# Altium schematic sheet LineFollowerSensor.SchDoc: das
size 635 x 281 mm
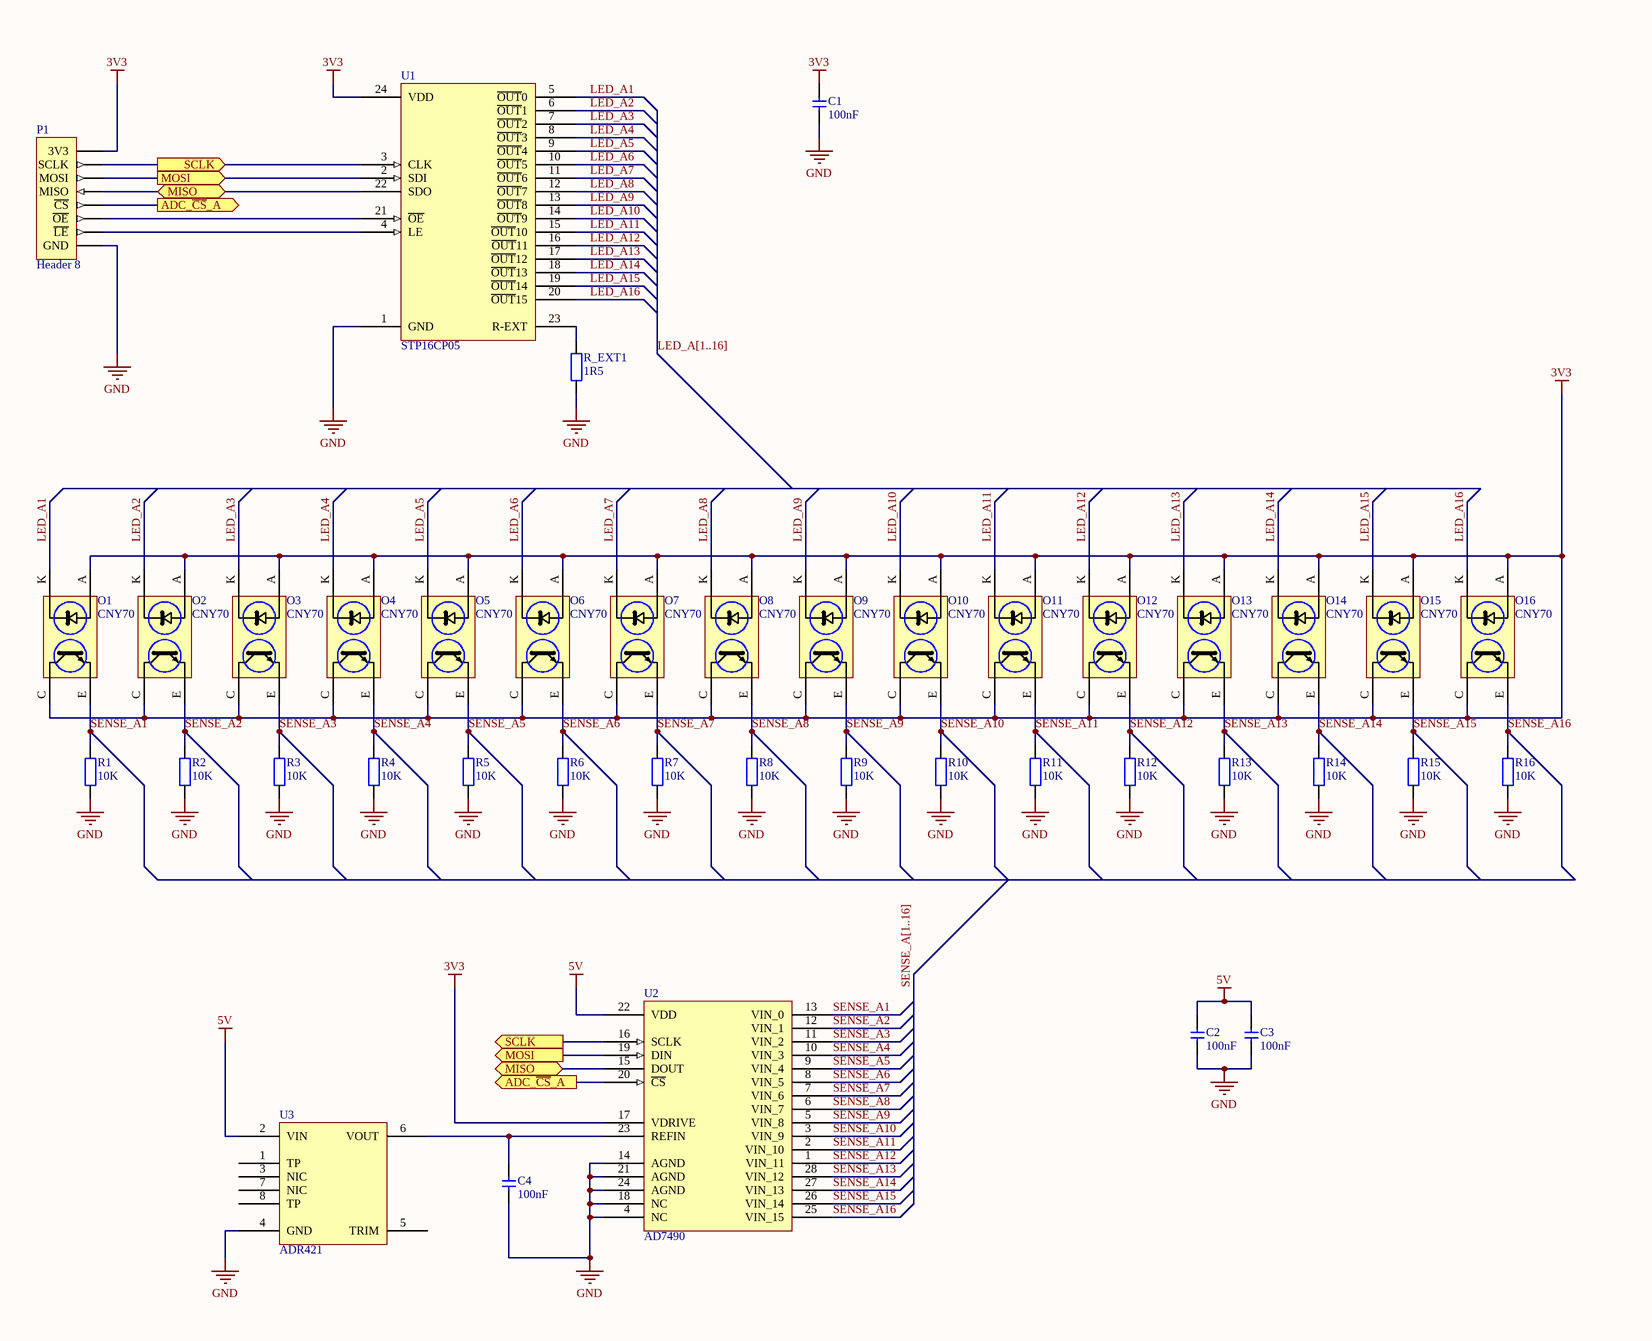
[diagram p0: LineFollowerSensor.SchDoc, left]
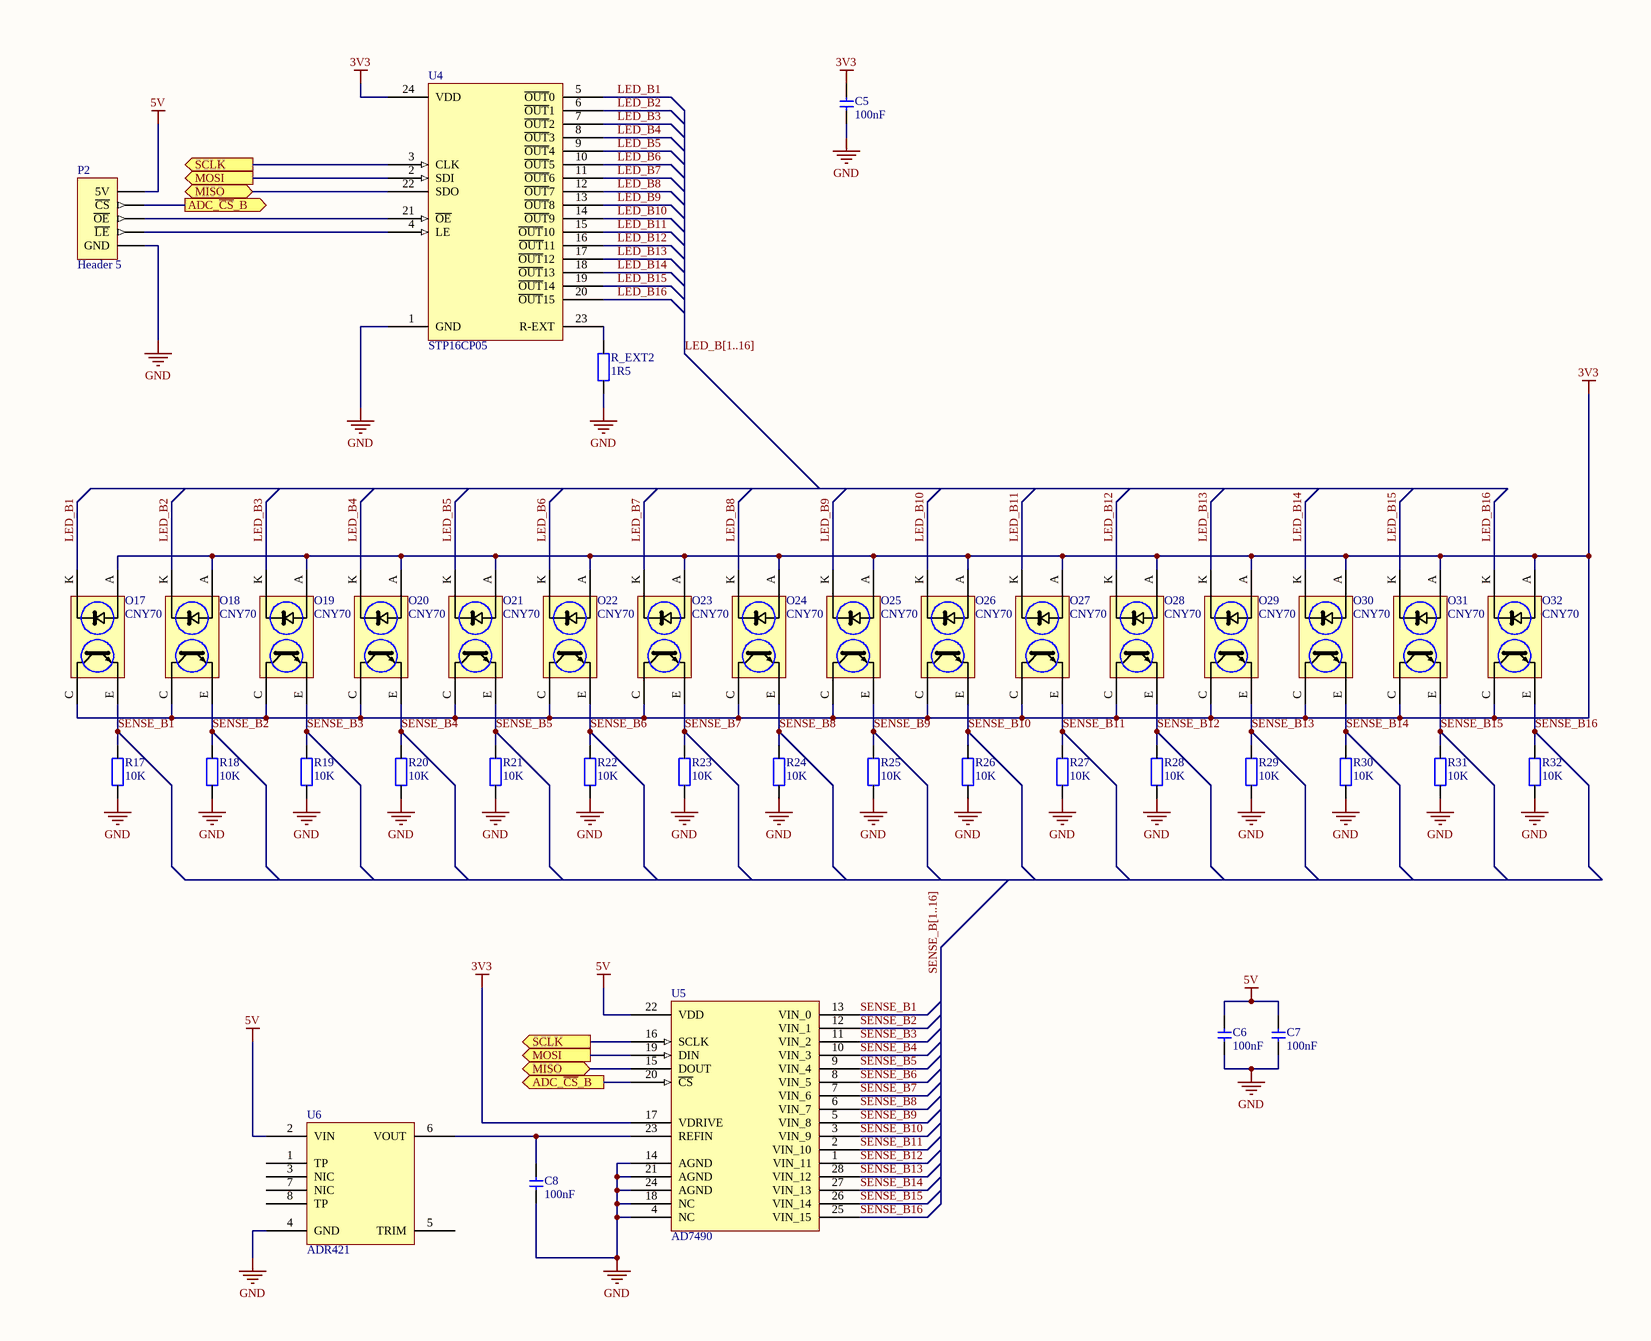
[diagram p1: LineFollowerSensor.SchDoc, right]

## Parts
C1  100nF  [FP_0805_CAP_085]
C2  100nF  [FP_0805_CAP_085]
C3  100nF  [FP_0805_CAP_085]
C4  100nF  [FP_0805_CAP_085]
C5  100nF  [FP_0805_CAP_085]
C6  100nF  [FP_0805_CAP_085]
C7  100nF  [FP_0805_CAP_085]
C8  100nF  [FP_0805_CAP_085]
O1  CNY70  [FP_CNY70]
O2  CNY70  [FP_CNY70]
O3  CNY70  [FP_CNY70]
O4  CNY70  [FP_CNY70]
O5  CNY70  [FP_CNY70]
O6  CNY70  [FP_CNY70]
O7  CNY70  [FP_CNY70]
O8  CNY70  [FP_CNY70]
O9  CNY70  [FP_CNY70]
O10  CNY70  [FP_CNY70]
O11  CNY70  [FP_CNY70]
O12  CNY70  [FP_CNY70]
O13  CNY70  [FP_CNY70]
O14  CNY70  [FP_CNY70]
O15  CNY70  [FP_CNY70]
O16  CNY70  [FP_CNY70]
O17  CNY70  [FP_CNY70]
O18  CNY70  [FP_CNY70]
O19  CNY70  [FP_CNY70]
O20  CNY70  [FP_CNY70]
O21  CNY70  [FP_CNY70]
O22  CNY70  [FP_CNY70]
O23  CNY70  [FP_CNY70]
O24  CNY70  [FP_CNY70]
O25  CNY70  [FP_CNY70]
O26  CNY70  [FP_CNY70]
O27  CNY70  [FP_CNY70]
O28  CNY70  [FP_CNY70]
O29  CNY70  [FP_CNY70]
O30  CNY70  [FP_CNY70]
O31  CNY70  [FP_CNY70]
O32  CNY70  [FP_CNY70]
P1  Header 8  [HDR1X8]
P2  Header 5  [HDR1X5]
R1  10K  [FP_0805_RES]
R2  10K  [FP_0805_RES]
R3  10K  [FP_0805_RES]
R4  10K  [FP_0805_RES]
R5  10K  [FP_0805_RES]
R6  10K  [FP_0805_RES]
R7  10K  [FP_0805_RES]
R8  10K  [FP_0805_RES]
R9  10K  [FP_0805_RES]
R10  10K  [FP_0805_RES]
R11  10K  [FP_0805_RES]
R12  10K  [FP_0805_RES]
R13  10K  [FP_0805_RES]
R14  10K  [FP_0805_RES]
R15  10K  [FP_0805_RES]
R16  10K  [FP_0805_RES]
R17  10K  [FP_0805_RES]
R18  10K  [FP_0805_RES]
R19  10K  [FP_0805_RES]
R20  10K  [FP_0805_RES]
R21  10K  [FP_0805_RES]
R22  10K  [FP_0805_RES]
R23  10K  [FP_0805_RES]
R24  10K  [FP_0805_RES]
R25  10K  [FP_0805_RES]
R26  10K  [FP_0805_RES]
R27  10K  [FP_0805_RES]
R28  10K  [FP_0805_RES]
R29  10K  [FP_0805_RES]
R30  10K  [FP_0805_RES]
R31  10K  [FP_0805_RES]
R32  10K  [FP_0805_RES]
R_EXT1  1R5  [FP_0805_RES]
R_EXT2  1R5  [FP_0805_RES]
U1  STP16CP05  [TSSOP24]
U2  AD7490  [TSSOP28]
U3  ADR421  [SOIC8]
U4  STP16CP05  [TSSOP24]
U5  AD7490  [TSSOP28]
U6  ADR421  [SOIC8]

## Ports
ADC_~{CS}_A (out), ADC_~{CS}_B (out), MISO (bidir), MOSI (out), SCLK (out)

## Nets
3V3: C1.2 C5.2 O1.A(Anode) O1.C(Coll) O2.A(Anode) O2.C(Coll) O3.A(Anode) O3.C(Coll) O4.A(Anode) O4.C(Coll) O5.A(Anode) O5.C(Coll) O6.A(Anode) O6.C(Coll) O7.A(Anode) O7.C(Coll) O8.A(Anode) O8.C(Coll) O9.A(Anode) O9.C(Coll) O10.A(Anode) O10.C(Coll) O11.A(Anode) O11.C(Coll) O12.A(Anode) O12.C(Coll) O13.A(Anode) O13.C(Coll) O14.A(Anode) O14.C(Coll) O15.A(Anode) O15.C(Coll) O16.A(Anode) O16.C(Coll) O17.A(Anode) O17.C(Coll) O18.A(Anode) O18.C(Coll) O19.A(Anode) O19.C(Coll) O20.A(Anode) O20.C(Coll) O21.A(Anode) O21.C(Coll) O22.A(Anode) O22.C(Coll) O23.A(Anode) O23.C(Coll) O24.A(Anode) O24.C(Coll) O25.A(Anode) O25.C(Coll) O26.A(Anode) O26.C(Coll) O27.A(Anode) O27.C(Coll) O28.A(Anode) O28.C(Coll) O29.A(Anode) O29.C(Coll) O30.A(Anode) O30.C(Coll) O31.A(Anode) O31.C(Coll) O32.A(Anode) O32.C(Coll) P1.1(3V3) U1.24(VDD) U2.17(VDRIVE) U4.24(VDD) U5.17(VDRIVE)
5V: C2.2 C3.2 C6.2 C7.2 P2.1(5V) U2.22(VDD) U3.2(VIN) U5.22(VDD) U6.2(VIN)
GND: C1.1 C2.1 C3.1 C4.1 C5.1 C6.1 C7.1 C8.1 P1.8(GND) P2.5(GND) R1.2 R2.1 R3.1 R4.1 R5.1 R6.1 R7.1 R8.1 R9.1 R10.1 R11.1 R12.1 R13.1 R14.1 R15.1 R16.1 R17.2 R18.1 R19.1 R20.1 R21.1 R22.1 R23.1 R24.1 R25.1 R26.1 R27.1 R28.1 R29.1 R30.1 R31.1 R32.1 R_EXT1.1 R_EXT2.1 U1.1(GND) U2.4(NC) U2.14(AGND) U2.18(NC) U2.21(AGND) U2.24(AGND) U3.4(GND) U4.1(GND) U5.4(NC) U5.14(AGND) U5.18(NC) U5.21(AGND) U5.24(AGND) U6.4(GND)
ADC_~{CS}_A: P1.5(~{CS}) U2.20(~{CS}) ; port ADC_~{CS}_A
ADC_~{CS}_B: P2.2(~{CS}) U5.20(~{CS}) ; port ADC_~{CS}_B
LED_A1: O1.K(Cath) U1.5(~{OUT}0)
LED_A2: O2.K(Cath) U1.6(~{OUT}1)
LED_A3: O3.K(Cath) U1.7(~{OUT}2)
LED_A4: O4.K(Cath) U1.8(~{OUT}3)
LED_A5: O5.K(Cath) U1.9(~{OUT}4)
LED_A6: O6.K(Cath) U1.10(~{OUT}5)
LED_A7: O7.K(Cath) U1.11(~{OUT}6)
LED_A8: O8.K(Cath) U1.12(~{OUT}7)
LED_A9: O9.K(Cath) U1.13(~{OUT}8)
LED_A10: O10.K(Cath) U1.14(~{OUT}9)
LED_A11: O11.K(Cath) U1.15(~{OUT}10)
LED_A12: O12.K(Cath) U1.16(~{OUT}11)
LED_A13: O13.K(Cath) U1.17(~{OUT}12)
LED_A14: O14.K(Cath) U1.18(~{OUT}13)
LED_A15: O15.K(Cath) U1.19(~{OUT}14)
LED_A16: O16.K(Cath) U1.20(~{OUT}15)
LED_B1: O17.K(Cath) U4.5(~{OUT}0)
LED_B2: O18.K(Cath) U4.6(~{OUT}1)
LED_B3: O19.K(Cath) U4.7(~{OUT}2)
LED_B4: O20.K(Cath) U4.8(~{OUT}3)
LED_B5: O21.K(Cath) U4.9(~{OUT}4)
LED_B6: O22.K(Cath) U4.10(~{OUT}5)
LED_B7: O23.K(Cath) U4.11(~{OUT}6)
LED_B8: O24.K(Cath) U4.12(~{OUT}7)
LED_B9: O25.K(Cath) U4.13(~{OUT}8)
LED_B10: O26.K(Cath) U4.14(~{OUT}9)
LED_B11: O27.K(Cath) U4.15(~{OUT}10)
LED_B12: O28.K(Cath) U4.16(~{OUT}11)
LED_B13: O29.K(Cath) U4.17(~{OUT}12)
LED_B14: O30.K(Cath) U4.18(~{OUT}13)
LED_B15: O31.K(Cath) U4.19(~{OUT}14)
LED_B16: O32.K(Cath) U4.20(~{OUT}15)
MISO: P1.4(MISO) U1.22(SDO) U2.15(DOUT) U4.22(SDO) U5.15(DOUT) ; port MISO
MOSI: P1.3(MOSI) U1.2(SDI) U2.19(DIN) U4.2(SDI) U5.19(DIN) ; port MOSI
SCLK: P1.2(SCLK) U1.3(CLK) U2.16(SCLK) U4.3(CLK) U5.16(SCLK) ; port SCLK
SENSE_A1: O1.E(Em) R1.1 U2.13(VIN_0)
SENSE_A2: O2.E(Em) R2.2 U2.12(VIN_1)
SENSE_A3: O3.E(Em) R3.2 U2.11(VIN_2)
SENSE_A4: O4.E(Em) R4.2 U2.10(VIN_3)
SENSE_A5: O5.E(Em) R5.2 U2.9(VIN_4)
SENSE_A6: O6.E(Em) R6.2 U2.8(VIN_5)
SENSE_A7: O7.E(Em) R7.2 U2.7(VIN_6)
SENSE_A8: O8.E(Em) R8.2 U2.6(VIN_7)
SENSE_A9: O9.E(Em) R9.2 U2.5(VIN_8)
SENSE_A10: O10.E(Em) R10.2 U2.3(VIN_9)
SENSE_A11: O11.E(Em) R11.2 U2.2(VIN_10)
SENSE_A12: O12.E(Em) R12.2 U2.1(VIN_11)
SENSE_A13: O13.E(Em) R13.2 U2.28(VIN_12)
SENSE_A14: O14.E(Em) R14.2 U2.27(VIN_13)
SENSE_A15: O15.E(Em) R15.2 U2.26(VIN_14)
SENSE_A16: O16.E(Em) R16.2 U2.25(VIN_15)
SENSE_B1: O17.E(Em) R17.1 U5.13(VIN_0)
SENSE_B2: O18.E(Em) R18.2 U5.12(VIN_1)
SENSE_B3: O19.E(Em) R19.2 U5.11(VIN_2)
SENSE_B4: O20.E(Em) R20.2 U5.10(VIN_3)
SENSE_B5: O21.E(Em) R21.2 U5.9(VIN_4)
SENSE_B6: O22.E(Em) R22.2 U5.8(VIN_5)
SENSE_B7: O23.E(Em) R23.2 U5.7(VIN_6)
SENSE_B8: O24.E(Em) R24.2 U5.6(VIN_7)
SENSE_B9: O25.E(Em) R25.2 U5.5(VIN_8)
SENSE_B10: O26.E(Em) R26.2 U5.3(VIN_9)
SENSE_B11: O27.E(Em) R27.2 U5.2(VIN_10)
SENSE_B12: O28.E(Em) R28.2 U5.1(VIN_11)
SENSE_B13: O29.E(Em) R29.2 U5.28(VIN_12)
SENSE_B14: O30.E(Em) R30.2 U5.27(VIN_13)
SENSE_B15: O31.E(Em) R31.2 U5.26(VIN_14)
SENSE_B16: O32.E(Em) R32.2 U5.25(VIN_15)
NetC4_2: C4.2 U2.23(REFIN) U3.6(VOUT)
NetC8_2: C8.2 U5.23(REFIN) U6.6(VOUT)
NetP1_6: P1.6(~{OE}) U1.21(~{OE})
NetP1_7: P1.7(~{LE}) U1.4(LE)
NetP2_3: P2.3(~{OE}) U4.21(~{OE})
NetP2_4: P2.4(~{LE}) U4.4(LE)
NetR_EXT1_2: R_EXT1.2 U1.23(R-EXT)
NetR_EXT2_2: R_EXT2.2 U4.23(R-EXT)

Not connected (* = marked no-connect by the designer): U3 1(TP) 3(NIC) 5(TRIM) 7(NIC) 8(TP); U6 1(TP) 3(NIC) 5(TRIM) 7(NIC) 8(TP)

## Buses and harness runs
bus LED_A[1..16]
bus LED_B[1..16]
bus SENSE_A[1..16]
bus SENSE_B[1..16]

## Library data of the parts
C1-C8 = CAP_100nF: YAGEO Ceramic Capacitor; Voltage: 50; Tolerance: 10%; Characteristic: X7R; Supplier: RET 93-04-28; Value: 100nF
O1-O32 = CNY70: Optoérzékelő, CNY70; Supplier: Lomex 38-00-43
P1 = Header 8: Header, 8-Pin; LatestRevisionDate: 17-Jul-2002; LatestRevisionNote: Re-released for DXP Platform.; Publisher: Altium Limited
P2 = Header 5: Header, 5-Pin; LatestRevisionDate: 17-Jul-2002; LatestRevisionNote: Re-released for DXP Platform.; Publisher: Altium Limited
R1-R32 = RES_10K: YAGEO SMD RESISTOR; Power: 125 mW; Tolerance: 1%; Supplier: RET 96-02-32; Value: 10K
R_EXT1 R_EXT2 = RES_1R5: YAGEO SMD RESISTOR; Power: 125 mW; Tolerance: 1%; Value: 1.5R; Supplier: RET 96-01-50
U1 U4 = STP16CP05: 16 channel constant current LED driver; Output current: 5-100mA; f max: 30MHz; Supplier: minta?
U2 U5 = AD7490: 16 channel analog digital converter; Vin range: 0-5V; Supplier: Analog Devices - sample
U3 U6 = ADR421: Reference voltage generator; Output voltage: 2.5V; Supplier: Analog Devices - sample